# Altium schematic sheet 01-POWER AC-DC.SchDoc
size A4; SheetNumber: 5; SheetTotal: 6; SPICEModelCacheOUJAJSNC: <root> / <DocumentId>OUJAJSNC</DocumentId> / </root>
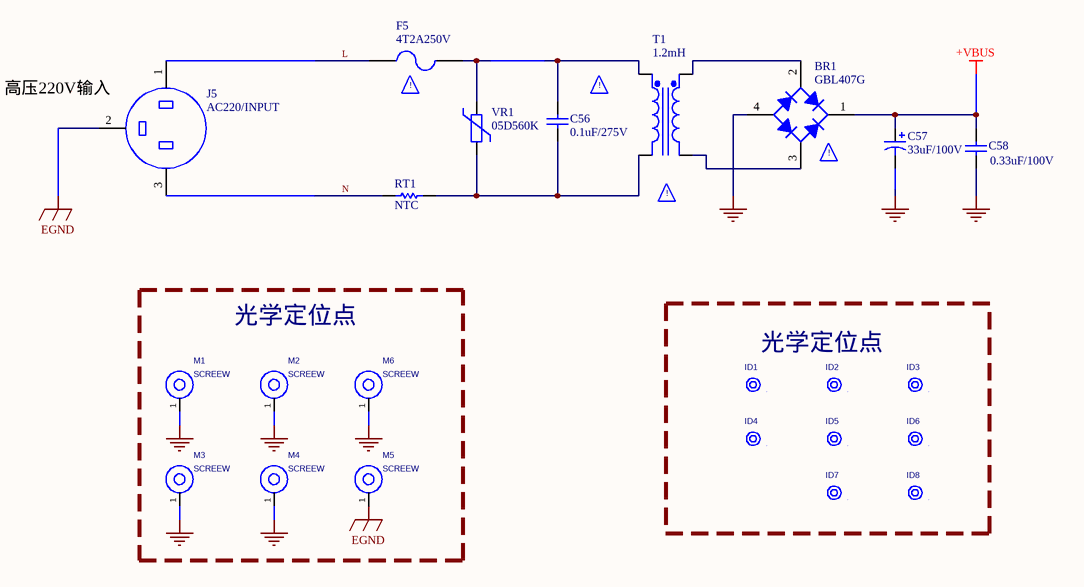
[diagram p0: 01-POWER AC-DC.SchDoc]

## Parts
BR1  GBL407G  [GBL407G]
C56  value 0.1uF/275V  [CBB62-275VAC-104K]  (hidden comment: Cap)
C57  33uF/100V  [CE16250SH1]
C58  value 0.33uF/100V  [AF334J1J079L270D9H]  (hidden comment: Cap)
F5  Fuse 2  [4T2A250V]  (value not drawn)
ID1  LOC  [MARK_1]  (value not drawn)
ID2  LOC  [MARK_1]  (value not drawn)
ID3  LOC  [MARK_1]  (value not drawn)
ID4  LOC  [MARK_1]  (value not drawn)
ID5  LOC  [MARK_1]  (value not drawn)
ID6  LOC  [MARK_1]  (value not drawn)
ID7  LOC  [MARK_1]  (value not drawn)
ID8  LOC  [MARK_1]  (value not drawn)
J5  AC220/INPUT  [VH-3A]
M1  value SCREEW  [SCREEW]  (hidden comment: MARK_4)
M2  value SCREEW  [SCREEW]  (hidden comment: MARK_4)
M3  value SCREEW  [SCREEW]  (hidden comment: MARK_4)
M4  value SCREEW  [SCREEW]  (hidden comment: MARK_4)
M5  value SCREEW  [SCREEW]  (hidden comment: MARK_4)
M6  value SCREEW  [SCREEW]  (hidden comment: MARK_4)
RT1  NTC  [NTC-10D9]
T1  1.2mH  [UU1014]
VR1  05D560K  [RUEF400]

## Blocks framed on the sheet
光学定位点: M1-M6
光学定位点: ID1-ID8

## Nets
+VBUS: BR1.1(K) C57.1 C58.2
EGND: J5.2 M5.1
GND: BR1.4(A) C57.2 C58.1 M1.1 M2.1 M3.1 M4.1 M6.1
L: F5.1 J5.1
N: J5.3 RT1.1
NetBR1_2: BR1.2(C) T1.3(Sec+)
NetBR1_3: BR1.3(C) T1.4(Sec-)
NetC56_1: C56.1 F5.2 T1.1(Pri+) VR1.2
NetC56_2: C56.2 RT1.2 T1.2(Pri-) VR1.1

Not connected (* = marked no-connect by the designer): ID1 1; ID2 1; ID3 1; ID4 1; ID5 1; ID6 1; ID7 1; ID8 1

## Notes on the sheet
- (near J5) 高压220V输入
- (near F5) !
- !
- (near T1) !
- (near BR1) !
- (in symbol Fuse 2) 4T2A250V

## Library data of the parts
BR1 = Bridge1: Full Wave Diode Bridge; Published: 8-Jun-2000; LatestRevisionDate: 17-Jul-2002; LatestRevisionNote: Re-released for DXP Platform.; Publisher: Altium Limited
C56 C58 = Cap: Capacitor; Published: 8-Jun-2000; LatestRevisionDate: 17-Jul-2002; LatestRevisionNote: Re-released for DXP Platform.; Publisher: Altium Limited
C57 = Cap Pol1: Polarized Capacitor (Radial); Published: 8-Jun-2000; LatestRevisionDate: 17-Jul-2002; LatestRevisionNote: Re-released for DXP Platform.; Publisher: Altium Limited; Value: 33uF/100V
F5 = Fuse 2: Fuse; Published: 8-Jun-2000; LatestRevisionDate: 17-Jul-2002; LatestRevisionNote: Re-released for DXP Platform.; Publisher: Altium Limited
ID1-ID8 = LOC: SMT_Locotion; PCB DECAL: MARK
M1-M6 = MARK_4: MARK Symble; RK_PN: MARK01; Priority: A; Created_by: CZD; Source_Path: C:\USERS\STQ\DESKTOP\RK3399_BOX\RK3399_BOX_SCH_V1.0_20180521.DSN; Part_Type: MARK; PCB DECAL: MARK
RT1 = Res1: Resistor; Value: 1K; Published: 8-Jun-2000; LatestRevisionDate: 17-Jul-2002; LatestRevisionNote: Re-released for DXP Platform.; Publisher: Altium Limited
T1 = Trans Eq: Transformer (Equivalent Circuit Model); Published: 8-Jun-2000; LatestRevisionDate: 17-Jul-2002; LatestRevisionNote: Re-released for DXP Platform.; Publisher: Altium Limited
VR1 = VR 561K